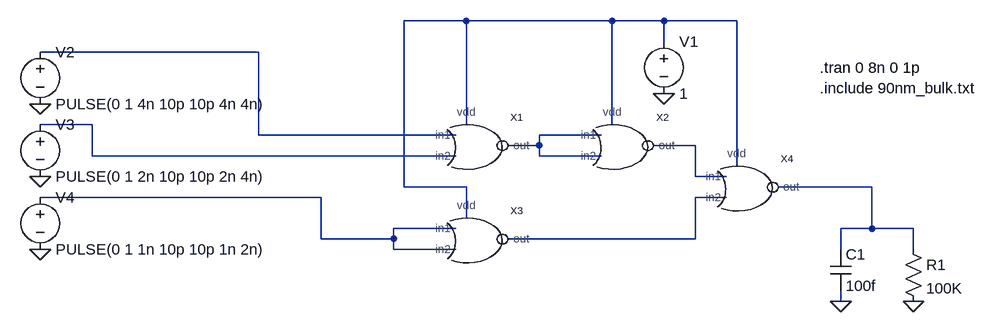
[diagram p0: schematic Formula-test.asc]
Formula-test.asc, the LTspice schematic file:
Version 4
SHEET 1 952 680
WIRE 112 -192 16 -192
WIRE 336 -192 112 -192
WIRE 416 -192 336 -192
WIRE 528 -192 416 -192
WIRE 416 -160 416 -192
WIRE -208 -144 -544 -144
WIRE -464 -32 -544 -32
WIRE 112 -32 112 -192
WIRE 336 -32 336 -192
WIRE -208 -16 -208 -144
WIRE 96 -16 -208 -16
WIRE 320 -16 224 -16
WIRE 224 0 224 -16
WIRE 224 0 176 0
WIRE 464 0 400 0
WIRE -464 16 -464 -32
WIRE 96 16 -464 16
WIRE 224 16 224 0
WIRE 320 16 224 16
WIRE 528 32 528 -192
WIRE 464 48 464 0
WIRE 512 48 464 48
WIRE 16 64 16 -192
WIRE 112 64 16 64
WIRE 736 64 592 64
WIRE -112 80 -544 80
WIRE 512 80 464 80
WIRE 112 112 112 64
WIRE 96 128 0 128
WIRE 736 128 736 64
WIRE 736 128 688 128
WIRE 800 128 736 128
WIRE -112 144 -112 80
WIRE 0 144 0 128
WIRE 0 144 -112 144
WIRE 464 144 464 80
WIRE 464 144 176 144
WIRE 0 160 0 144
WIRE 96 160 0 160
WIRE 688 160 688 128
WIRE 800 160 800 128
WIRE 688 240 688 224
FLAG 416 -80 0
FLAG 688 240 0
FLAG 800 240 0
FLAG -544 -64 0
FLAG -544 48 0
FLAG -544 160 0
SYMBOL voltage 416 -176 R0
WINDOW 123 0 0 Left 2
WINDOW 39 0 0 Left 2
SYMATTR InstName V1
SYMATTR Value 1
SYMBOL voltage -544 -160 R0
WINDOW 123 0 0 Left 2
WINDOW 39 0 0 Left 2
SYMATTR InstName V2
SYMATTR Value PULSE(0 1 4n 10p 10p 4n 4n)
SYMBOL res 784 144 R0
SYMATTR InstName R1
SYMATTR Value 100K
SYMBOL cap 672 160 R0
SYMATTR InstName C1
SYMATTR Value 100f
SYMBOL voltage -544 -48 R0
WINDOW 123 0 0 Left 2
WINDOW 39 0 0 Left 2
SYMATTR InstName V3
SYMATTR Value PULSE(0 1 2n 10p 10p 2n 4n)
SYMBOL voltage -544 64 R0
WINDOW 123 0 0 Left 2
WINDOW 39 0 0 Left 2
SYMATTR InstName V4
SYMATTR Value PULSE(0 1 1n 10p 10p 1n 2n)
SYMBOL nor 112 0 R0
SYMATTR InstName X1
SYMBOL nor 336 0 R0
SYMATTR InstName X2
SYMBOL nor 112 144 R0
SYMATTR InstName X3
SYMBOL nor 528 64 R0
SYMATTR InstName X4
TEXT 656 -120 Left 2 !.tran 0 8n 0 1p
TEXT 656 -88 Left 2 !.include 90nm_bulk.txt

The netlist it stands for:
* Formula-test.asc
V1 N001 0 1
V2 N002 0 PULSE(0 1 4n 10p 10p 4n 4n)
R1 N006 0 100K
C1 N006 0 100f
V3 N003 0 PULSE(0 1 2n 10p 10p 2n 4n)
V4 N007 0 PULSE(0 1 1n 10p 10p 1n 2n)
XX1 N002 N003 N001 N004 nor  ; pins in1 in2 vdd out
XX2 N004 N004 N001 N005 nor  ; pins in1 in2 vdd out
XX3 N007 N007 N001 N008 nor  ; pins in1 in2 vdd out
XX4 N005 N008 N001 N006 nor  ; pins in1 in2 vdd out
.tran 0 8n 0 1p
.include 90nm_bulk.txt
.backanno
.end